# Altium project Zynq7000 SOM.PrjPcb (part 2 of 2)

## Sheet 1GB DDR3L Modules.SchDoc
size A3; SheetNumber: 8; SheetTotal: 11
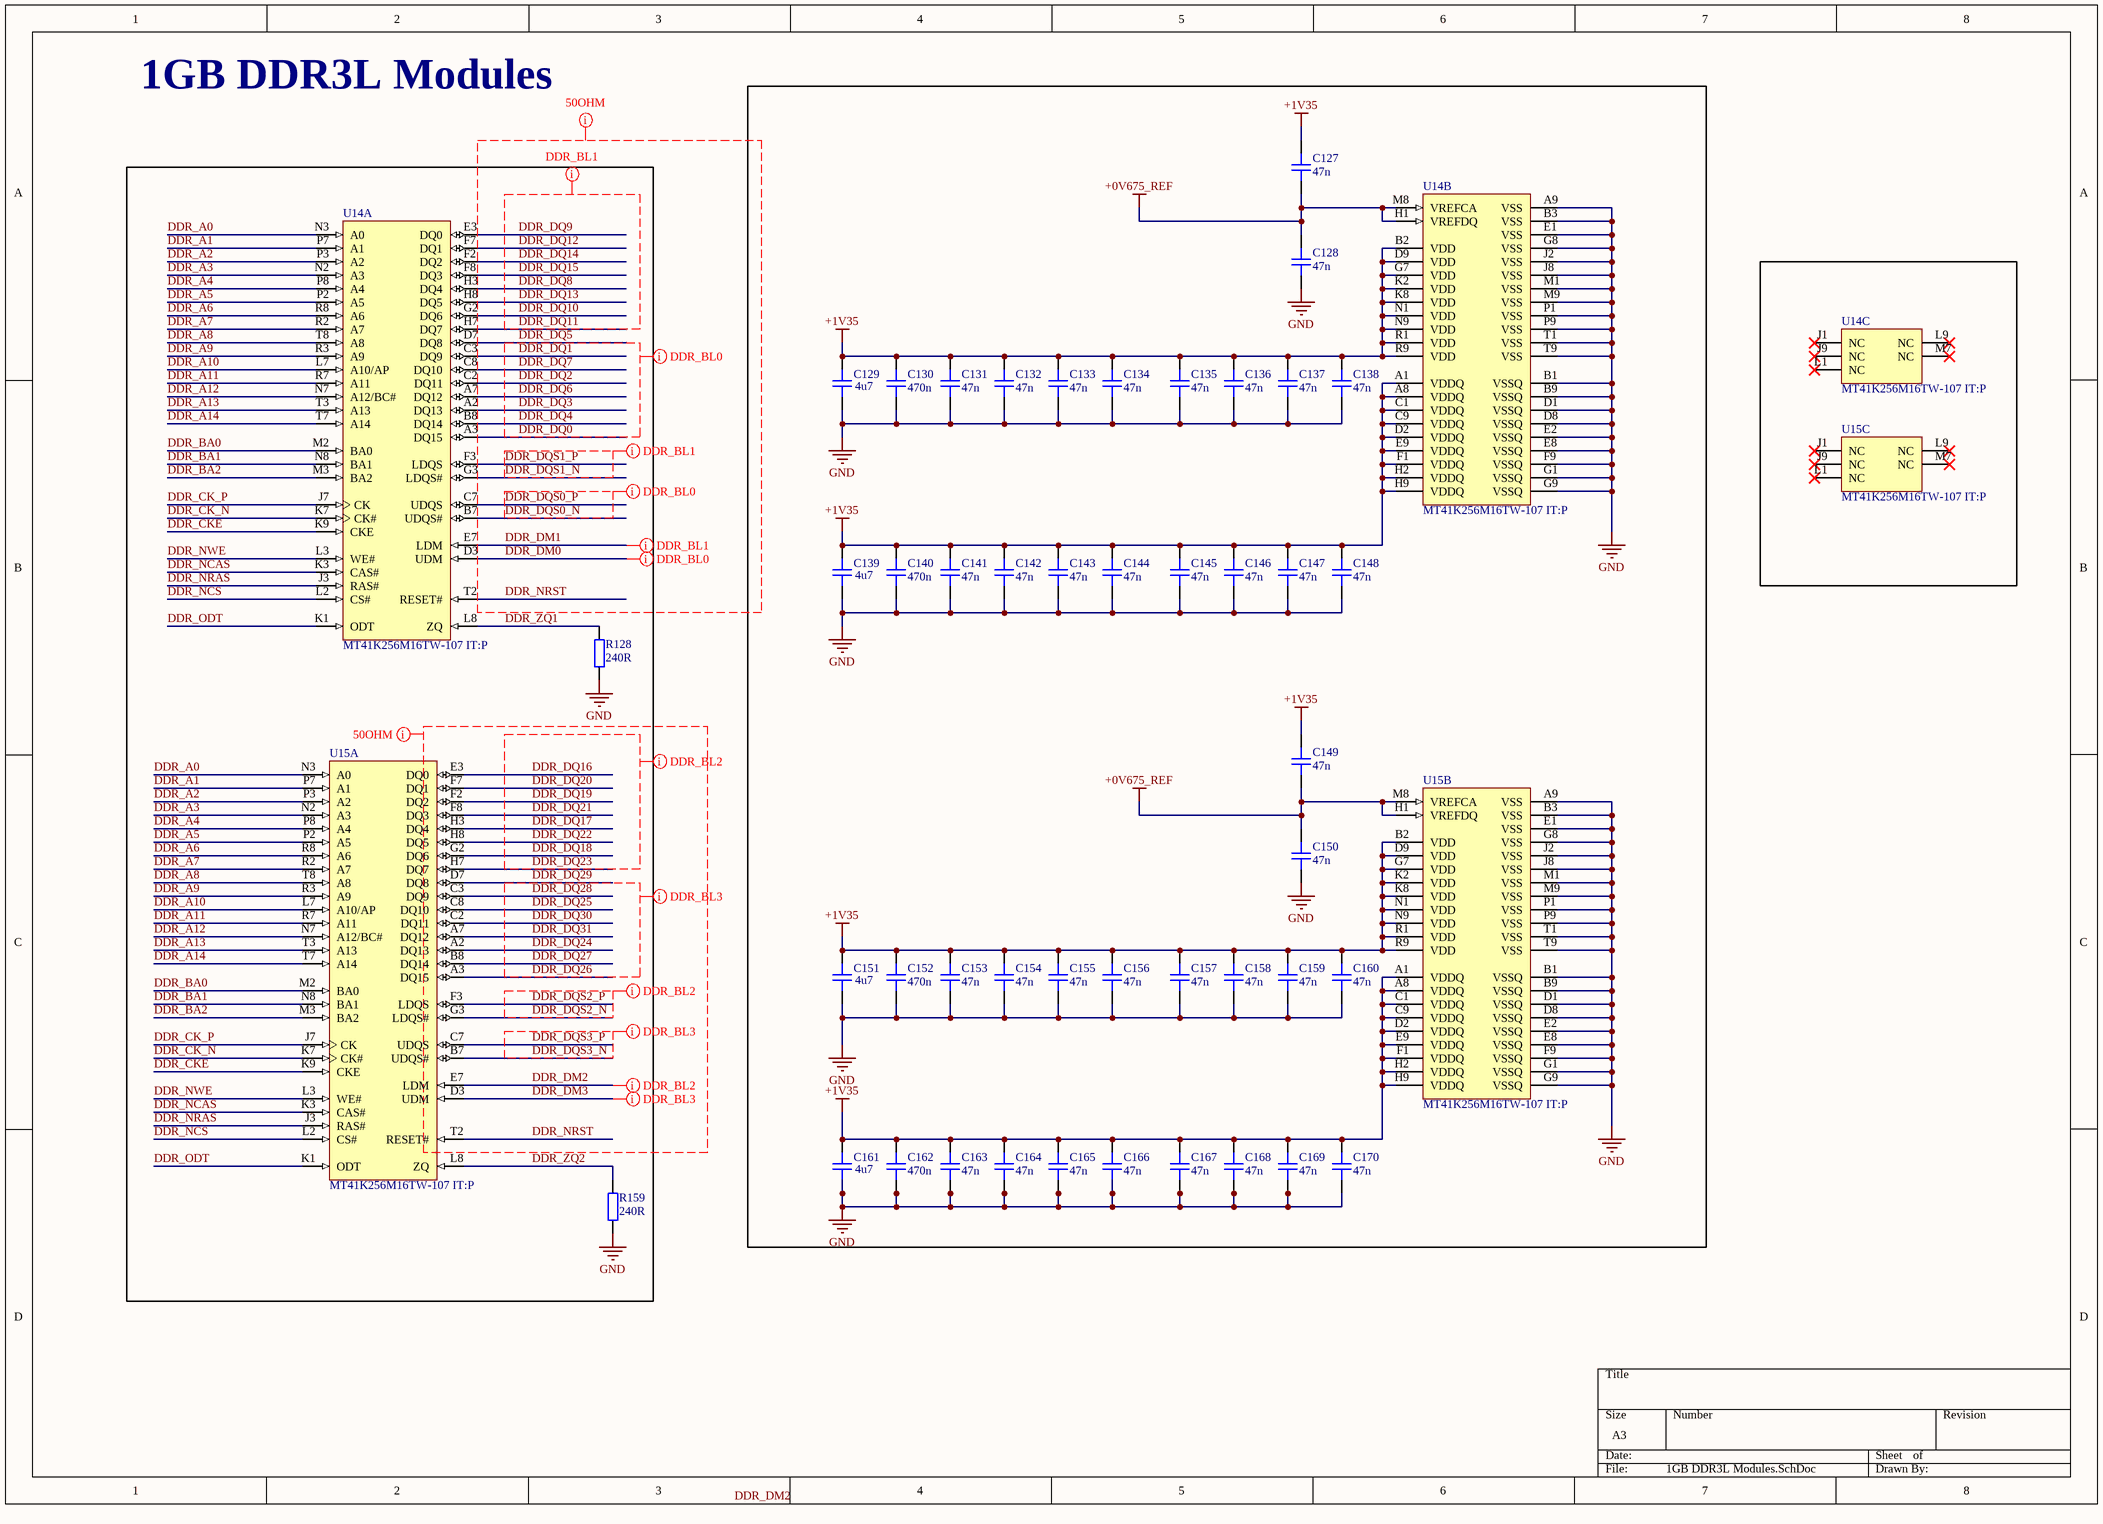
[diagram p9: 1GB DDR3L Modules.SchDoc]

### Parts
C127  value 47n  [CAP_0201]  (hidden comment: C0201)
C128  value 47n  [CAP_0201]  (hidden comment: C0201)
C129  value 4u7  [CAP_0402]  (hidden comment: C0402)
C130  value 470n  [CAP_0201]  (hidden comment: C0201)
C131  value 47n  [CAP_0201]  (hidden comment: C0201)
C132  value 47n  [CAP_0201]  (hidden comment: C0201)
C133  value 47n  [CAP_0201]  (hidden comment: C0201)
C134  value 47n  [CAP_0201]  (hidden comment: C0201)
C135  value 47n  [CAP_0201]  (hidden comment: C0201)
C136  value 47n  [CAP_0201]  (hidden comment: C0201)
C137  value 47n  [CAP_0201]  (hidden comment: C0201)
C138  value 47n  [CAP_0201]  (hidden comment: C0201)
C139  value 4u7  [CAP_0402]  (hidden comment: C0402)
C140  value 470n  [CAP_0201]  (hidden comment: C0201)
C141  value 47n  [CAP_0201]  (hidden comment: C0201)
C142  value 47n  [CAP_0201]  (hidden comment: C0201)
C143  value 47n  [CAP_0201]  (hidden comment: C0201)
C144  value 47n  [CAP_0201]  (hidden comment: C0201)
C145  value 47n  [CAP_0201]  (hidden comment: C0201)
C146  value 47n  [CAP_0201]  (hidden comment: C0201)
C147  value 47n  [CAP_0201]  (hidden comment: C0201)
C148  value 47n  [CAP_0201]  (hidden comment: C0201)
C149  value 47n  [CAP_0201]  (hidden comment: C0201)
C150  value 47n  [CAP_0201]  (hidden comment: C0201)
C151  value 4u7  [CAP_0402]  (hidden comment: C0402)
C152  value 470n  [CAP_0201]  (hidden comment: C0201)
C153  value 47n  [CAP_0201]  (hidden comment: C0201)
C154  value 47n  [CAP_0201]  (hidden comment: C0201)
C155  value 47n  [CAP_0201]  (hidden comment: C0201)
C156  value 47n  [CAP_0201]  (hidden comment: C0201)
C157  value 47n  [CAP_0201]  (hidden comment: C0201)
C158  value 47n  [CAP_0201]  (hidden comment: C0201)
C159  value 47n  [CAP_0201]  (hidden comment: C0201)
C160  value 47n  [CAP_0201]  (hidden comment: C0201)
C161  value 4u7  [CAP_0402]  (hidden comment: C0402)
C162  value 470n  [CAP_0201]  (hidden comment: C0201)
C163  value 47n  [CAP_0201]  (hidden comment: C0201)
C164  value 47n  [CAP_0201]  (hidden comment: C0201)
C165  value 47n  [CAP_0201]  (hidden comment: C0201)
C166  value 47n  [CAP_0201]  (hidden comment: C0201)
C167  value 47n  [CAP_0201]  (hidden comment: C0201)
C168  value 47n  [CAP_0201]  (hidden comment: C0201)
C169  value 47n  [CAP_0201]  (hidden comment: C0201)
C170  value 47n  [CAP_0201]  (hidden comment: C0201)
R128  value 240R  [RES_0402]  (hidden comment: R0402)
R159  value 240R  [RES_0402]  (hidden comment: R0402)
U14  MT41K256M16TW-107 IT:P  [MICT-TW-96]  (parts A,B,C of 3)
U15  MT41K256M16TW-107 IT:P  [MICT-TW-96]  (parts A,B,C of 3)

### Nets
+0V675_Ref: C127.1 C128.2 C149.1 C150.2 U14.H1(VREFDQ) U14.M8(VREFCA) U15.H1(VREFDQ) U15.M8(VREFCA)
+1V35: C127.2 C129.2 C130.2 C131.2 C132.2 C133.2 C134.2 C135.2 C136.2 C137.2 C138.2 C139.2 C140.2 C141.2 C142.2 C143.2 C144.2 C145.2 C146.2 C147.2 C148.2 C149.2 C151.2 C152.2 C153.2 C154.2 C155.2 C156.2 C157.2 C158.2 C159.2 C160.2 C161.2 C162.2 C163.2 C164.2 C165.2 C166.2 C167.2 C168.2 C169.2 C170.2 U14.A1(VDDQ) U14.A8(VDDQ) U14.B2(VDD) U14.C1(VDDQ) U14.C9(VDDQ) U14.D2(VDDQ) U14.D9(VDD) U14.E9(VDDQ) U14.F1(VDDQ) U14.G7(VDD) U14.H2(VDDQ) U14.H9(VDDQ) U14.K2(VDD) U14.K8(VDD) U14.N1(VDD) U14.N9(VDD) U14.R1(VDD) U14.R9(VDD) U15.A1(VDDQ) U15.A8(VDDQ) U15.B2(VDD) U15.C1(VDDQ) U15.C9(VDDQ) U15.D2(VDDQ) U15.D9(VDD) U15.E9(VDDQ) U15.F1(VDDQ) U15.G7(VDD) U15.H2(VDDQ) U15.H9(VDDQ) U15.K2(VDD) U15.K8(VDD) U15.N1(VDD) U15.N9(VDD) U15.R1(VDD) U15.R9(VDD)
GND: C128.1 C129.1 C130.1 C131.1 C132.1 C133.1 C134.1 C135.1 C136.1 C137.1 C138.1 C139.1 C140.1 C141.1 C142.1 C143.1 C144.1 C145.1 C146.1 C147.1 C148.1 C150.1 C151.1 C152.1 C153.1 C154.1 C155.1 C156.1 C157.1 C158.1 C159.1 C160.1 C161.1 C162.1 C163.1 C164.1 C165.1 C166.1 C167.1 C168.1 C169.1 C170.1 R128.2 R159.2 U14.A9(VSS) U14.B1(VSSQ) U14.B3(VSS) U14.B9(VSSQ) U14.D1(VSSQ) U14.D8(VSSQ) U14.E1(VSS) U14.E2(VSSQ) U14.E8(VSSQ) U14.F9(VSSQ) U14.G1(VSSQ) U14.G8(VSS) U14.G9(VSSQ) U14.J2(VSS) U14.J8(VSS) U14.M1(VSS) U14.M9(VSS) U14.P1(VSS) U14.P9(VSS) U14.T1(VSS) U14.T9(VSS) U15.A9(VSS) U15.B1(VSSQ) U15.B3(VSS) U15.B9(VSSQ) U15.D1(VSSQ) U15.D8(VSSQ) U15.E1(VSS) U15.E2(VSSQ) U15.E8(VSSQ) U15.F9(VSSQ) U15.G1(VSSQ) U15.G8(VSS) U15.G9(VSSQ) U15.J2(VSS) U15.J8(VSS) U15.M1(VSS) U15.M9(VSS) U15.P1(VSS) U15.P9(VSS) U15.T1(VSS) U15.T9(VSS)
DDR_A0: U14.N3(A0) U15.N3(A0)
DDR_A1: U14.P7(A1) U15.P7(A1)
DDR_A2: U14.P3(A2) U15.P3(A2)
DDR_A3: U14.N2(A3) U15.N2(A3)
DDR_A4: U14.P8(A4) U15.P8(A4)
DDR_A5: U14.P2(A5) U15.P2(A5)
DDR_A6: U14.R8(A6) U15.R8(A6)
DDR_A7: U14.R2(A7) U15.R2(A7)
DDR_A8: U14.T8(A8) U15.T8(A8)
DDR_A9: U14.R3(A9) U15.R3(A9)
DDR_A10: U14.L7(A10/AP) U15.L7(A10/AP)
DDR_A11: U14.R7(A11) U15.R7(A11)
DDR_A12: U14.N7(A12/BC#) U15.N7(A12/BC#)
DDR_A13: U14.T3(A13) U15.T3(A13)
DDR_A14: U14.T7(A14) U15.T7(A14)
DDR_BA0: U14.M2(BA0) U15.M2(BA0)
DDR_BA1: U14.N8(BA1) U15.N8(BA1)
DDR_BA2: U14.M3(BA2) U15.M3(BA2)
DDR_CK_N: U14.K7(CK#) U15.K7(CK#)
DDR_CK_P: U14.J7(CK) U15.J7(CK)
DDR_CKE: U14.K9(CKE) U15.K9(CKE)
DDR_DM0: U14.D3(UDM)
DDR_DM1: U14.E7(LDM)
DDR_DM2: U15.E7(LDM)
DDR_DM3: U15.D3(UDM)
DDR_DQ0: U14.A3(DQ15)
DDR_DQ1: U14.C3(DQ9)
DDR_DQ2: U14.C2(DQ11)
DDR_DQ3: U14.A2(DQ13)
DDR_DQ4: U14.B8(DQ14)
DDR_DQ5: U14.D7(DQ8)
DDR_DQ6: U14.A7(DQ12)
DDR_DQ7: U14.C8(DQ10)
DDR_DQ8: U14.H3(DQ4)
DDR_DQ9: U14.E3(DQ0)
DDR_DQ10: U14.G2(DQ6)
DDR_DQ11: U14.H7(DQ7)
DDR_DQ12: U14.F7(DQ1)
DDR_DQ13: U14.H8(DQ5)
DDR_DQ14: U14.F2(DQ2)
DDR_DQ15: U14.F8(DQ3)
DDR_DQ16: U15.E3(DQ0)
DDR_DQ17: U15.H3(DQ4)
DDR_DQ18: U15.G2(DQ6)
DDR_DQ19: U15.F2(DQ2)
DDR_DQ20: U15.F7(DQ1)
DDR_DQ21: U15.F8(DQ3)
DDR_DQ22: U15.H8(DQ5)
DDR_DQ23: U15.H7(DQ7)
DDR_DQ24: U15.A2(DQ13)
DDR_DQ25: U15.C8(DQ10)
DDR_DQ26: U15.A3(DQ15)
DDR_DQ27: U15.B8(DQ14)
DDR_DQ28: U15.C3(DQ9)
DDR_DQ29: U15.D7(DQ8)
DDR_DQ30: U15.C2(DQ11)
DDR_DQ31: U15.A7(DQ12)
DDR_DQS0_N: U14.B7(UDQS#)
DDR_DQS0_P: U14.C7(UDQS)
DDR_DQS1_N: U14.G3(LDQS#)
DDR_DQS1_P: U14.F3(LDQS)
DDR_DQS2_N: U15.G3(LDQS#)
DDR_DQS2_P: U15.F3(LDQS)
DDR_DQS3_N: U15.B7(UDQS#)
DDR_DQS3_P: U15.C7(UDQS)
DDR_NCAS: U14.K3(CAS#) U15.K3(CAS#)
DDR_NCS: U14.L2(CS#) U15.L2(CS#)
DDR_NRAS: U14.J3(RAS#) U15.J3(RAS#)
DDR_NRST: U14.T2(RESET#) U15.T2(RESET#)
DDR_NWE: U14.L3(WE#) U15.L3(WE#)
DDR_ODT: U14.K1(ODT) U15.K1(ODT)
DDR_ZQ1: R128.1 U14.L8(ZQ)
DDR_ZQ2: R159.1 U15.L8(ZQ)

Not connected (* = marked no-connect by the designer): U14 J1(NC)* J9(NC)* L1(NC)* L9(NC)* M7(NC)*; U15 J1(NC)* J9(NC)* L1(NC)* L9(NC)* M7(NC)*

### Layout directives
net class DDR_BL1: DDR_DM1, DDR_DQ8, DDR_DQ9, DDR_DQ10, DDR_DQ11, DDR_DQ12, DDR_DQ13, DDR_DQ14, DDR_DQ15, DDR_DQS1_N, DDR_DQS1_P
net class DDR_BL0: DDR_DM0, DDR_DQ0, DDR_DQ1, DDR_DQ2, DDR_DQ3, DDR_DQ4, DDR_DQ5, DDR_DQ6, DDR_DQ7, DDR_DQS0_N, DDR_DQS0_P
net class DDR_BL2: DDR_DM2, DDR_DQ16, DDR_DQ17, DDR_DQ18, DDR_DQ19, DDR_DQ20, DDR_DQ21, DDR_DQ22, DDR_DQ23, DDR_DQS2_N, DDR_DQS2_P
net class DDR_BL3: DDR_DM3, DDR_DQ24, DDR_DQ25, DDR_DQ26, DDR_DQ27, DDR_DQ28, DDR_DQ29, DDR_DQ30, DDR_DQ31, DDR_DQS3_N, DDR_DQS3_P
net class 50OHM: DDR_DM0, DDR_DM1, DDR_DM2, DDR_DM3, DDR_DQ0, DDR_DQ1, DDR_DQ2, DDR_DQ3, DDR_DQ4, DDR_DQ5, DDR_DQ6, DDR_DQ7, DDR_DQ8, DDR_DQ9, DDR_DQ10, DDR_DQ11, DDR_DQ12, DDR_DQ13, DDR_DQ14, DDR_DQ15, DDR_DQ16, DDR_DQ17, DDR_DQ18, DDR_DQ19, DDR_DQ20, DDR_DQ21, DDR_DQ22, DDR_DQ23, DDR_DQ24, DDR_DQ25, DDR_DQ26, DDR_DQ27, DDR_DQ28, DDR_DQ29, DDR_DQ30, DDR_DQ31, DDR_DQS0_N, DDR_DQS0_P, DDR_DQS1_N, DDR_DQS1_P, DDR_DQS2_N, DDR_DQS2_P, DDR_DQS3_N, DDR_DQS3_P, DDR_NRST

### Notes on the sheet
- 1GB DDR3L Modules
- Labels drawn without touching a wire or pin: DDR_DM2

### Library data of the parts
C127 C128 C130-C138 C140-C150 C152-C160 C162-C170 = CAP_0201: Capacitor SMD 0201; Rating: 16V; Manufacturer: *; Manufacturer Part Number: *; Distributor Link: *; LCSC: *; Dielectric: *
C129 C139 C151 C161 = CAP_0402: Capacitor SMD 0402; Manufacturer: *; Manufacturer Part Number: *; Distributor Link: *; LCSC: *; Rating: *; Dielectric: *
R128 R159 = RES_0402: Resistor SMD 0402; Manufacturer: *; Manufacturer Part Number: *; Distributor Link: *; LCSC: *
U14 U15 = CMP-2000-06773-2: Automotive DDR3L SDRAM, 4 GB, 933 MHz, 1.283 to 1.45 V, -40 to 95 degC, 96-Pin TFBGA, RoHS, Tray; Manufacturer: Micron; Data Bus Width: 16b; Address Bus Width: 15b; Operating Supply Voltage: 1.35V; Access Time: 1.07ns; Max Frequency: 933MHz; Density: 4Gb; Package Reference: TW-96; Max Operating Temperature: 95degC; RoHSCompliant: true; Datasheet Version: Rev. D, 02/2017; Datasheet URL: https://www.micron.com/~/media/documents/products/data-sheet/dram/ddr3/4gb_automotive_ddr3l.pdf; Mount: SurfaceMount; Min Operating Temperature: -40degC; Package Description: 96-Ball Fine Pitch Ball Grid Array, Body 14 x 8 mm, Pitch 0.8 mm; Mounting Technology: SurfaceMount; Contact Plating: Silver; Manufacturer URL: http://www.micron.com/

## Sheet Gigabit Ethernet.SchDoc
size A3; SheetNumber: 9; SheetTotal: 11
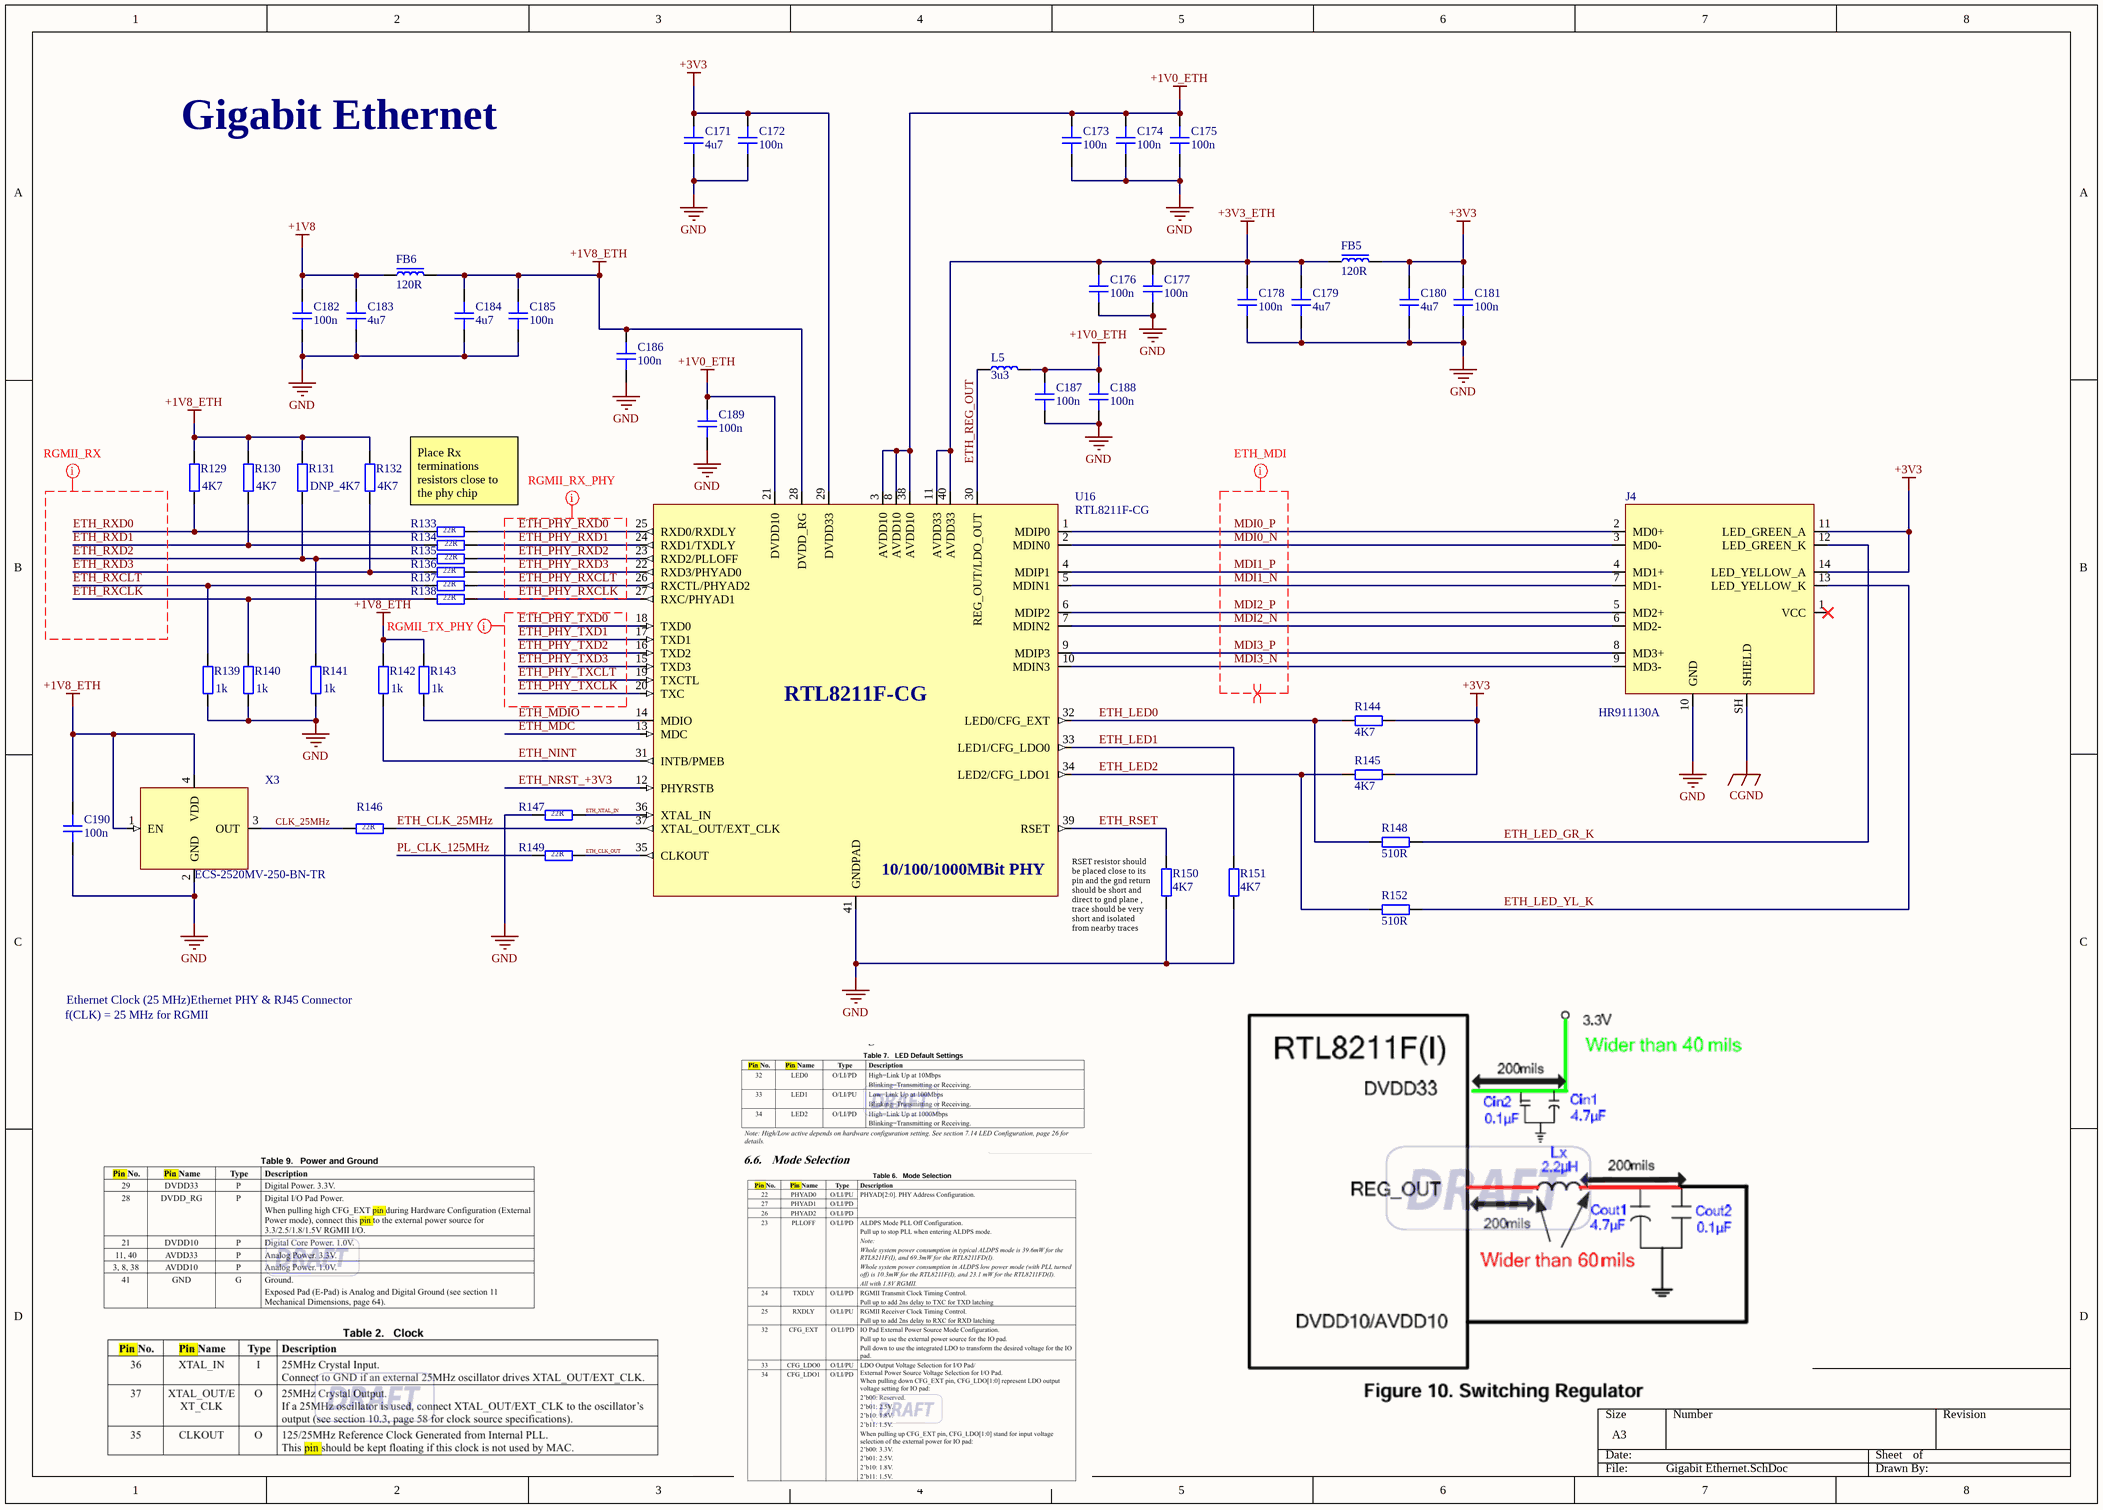
[diagram p10: Gigabit Ethernet.SchDoc]

### Parts
C171  4u7  [CAP_0402]
C172  100n  [CAP_0402]
C173  100n  [CAP_0402]
C174  100n  [CAP_0402]
C175  100n  [CAP_0402]
C176  100n  [CAP_0402]
C177  100n  [CAP_0402]
C178  100n  [CAP_0402]
C179  4u7  [CAP_0402]
C180  4u7  [CAP_0402]
C181  100n  [CAP_0402]
C182  100n  [CAP_0402]
C183  4u7  [CAP_0402]
C184  4u7  [CAP_0402]
C185  100n  [CAP_0402]
C186  100n  [CAP_0402]
C187  100n  [CAP_0402]
C188  100n  [CAP_0402]
C189  100n  [CAP_0402]
C190  100n  [CAP_0402]
FB5  120R  [FB_0402]
FB6  120R  [FB_0402]
J4  HR911130A  [HR911130A]
L5  value 3u3  [IND_0402]  (hidden comment: L0402)
R129  value 4K7  [RES_0402]  (hidden comment: R0402)
R130  value 4K7  [RES_0402]  (hidden comment: R0402)
R131  value DNP_4K7  [RES_0402]  (hidden comment: R0402)
R132  value 4K7  [RES_0402]  (hidden comment: R0402)
R133  value 22R  [RES_0402]  (hidden comment: R0402)
R134  value 22R  [RES_0402]  (hidden comment: R0402)
R135  value 22R  [RES_0402]  (hidden comment: R0402)
R136  value 22R  [RES_0402]  (hidden comment: R0402)
R137  value 22R  [RES_0402]  (hidden comment: R0402)
R138  value 22R  [RES_0402]  (hidden comment: R0402)
R139  value 1k  [RES_0402]  (hidden comment: R0402)
R140  value 1k  [RES_0402]  (hidden comment: R0402)
R141  value 1k  [RES_0402]  (hidden comment: R0402)
R142  value 1k  [RES_0402]  (hidden comment: R0402)
R143  value 1k  [RES_0402]  (hidden comment: R0402)
R144  value 4K7  [RES_0402]  (hidden comment: R0402)
R145  value 4K7  [RES_0402]  (hidden comment: R0402)
R146  value 22R  [RES_0402]  (hidden comment: R0402)
R147  value 22R  [RES_0402]  (hidden comment: R0402)
R148  value 510R  [RES_0402]  (hidden comment: R0402)
R149  value 22R  [RES_0402]  (hidden comment: R0402)
R150  value 4K7  [RES_0402]  (hidden comment: R0402)
R151  value 4K7  [RES_0402]  (hidden comment: R0402)
R152  value 510R  [RES_0402]  (hidden comment: R0402)
U16  RTL8211F-CG  [QFN-40-0.4-EP]
X3  ECS-2520MV-250-BN-TR  [XTAL_2520]

### Nets
+1V0_ETH: C173.2 C174.2 C175.2 C187.2 C188.2 C189.2 L5.2 U16.3(AVDD10) U16.8(AVDD10) U16.21(DVDD10) U16.38(AVDD10)
+1V8: C182.2 C183.2 FB6.1
+1V8_ETH: C184.2 C185.2 C186.2 C190.2 FB6.2 R129.2 R130.2 R131.2 R132.2 R142.2 R143.2 U16.28(DVDD_RG) X3.1(EN) X3.4(VDD)
+3V3: C171.2 C172.2 C180.2 C181.2 FB5.1 J4.11(LED_GREEN_A) J4.14(LED_YELLOW_A) R144.1 R145.1 U16.29(DVDD33)
+3V3_ETH: C176.2 C177.2 C178.2 C179.2 FB5.2 U16.11(AVDD33) U16.40(AVDD33)
CGND: J4.SH(SHIELD)
GND: C171.1 C172.1 C173.1 C174.1 C175.1 C176.1 C177.1 C178.1 C179.1 C180.1 C181.1 C182.1 C183.1 C184.1 C185.1 C186.1 C187.1 C188.1 C189.1 C190.1 J4.10(GND) R139.1 R140.1 R141.1 R147.2 R150.2 R151.2 U16.41(GNDPAD) X3.2(GND)
CLK_25MHz: R146.2 X3.3(OUT)
ETH_CLK_25MHz: R146.1 U16.37(XTAL_OUT/EXT_CLK)
ETH_CLK_OUT: R149.1 U16.35(CLKOUT)
ETH_LED0: R144.2 R148.2 U16.32(LED0/CFG_EXT)
ETH_LED1: R151.1 U16.33(LED1/CFG_LDO0)
ETH_LED2: R145.2 R152.2 U16.34(LED2/CFG_LDO1)
ETH_LED_GR_K: J4.12(LED_GREEN_K) R148.1
ETH_LED_YL_K: J4.13(LED_YELLOW_K) R152.1
ETH_MDC: U16.13(MDC)
ETH_MDIO: R143.1 U16.14(MDIO)
ETH_NINT: R142.1 U16.31(INTB/PMEB)
ETH_NRST_+3V3: U16.12(PHYRSTB)
ETH_PHY_RXCLK: R138.1 U16.27(RXC/PHYAD1)
ETH_PHY_RXCLT: R137.1 U16.26(RXCTL/PHYAD2)
ETH_PHY_RXD0: R133.1 U16.25(RXD0/RXDLY)
ETH_PHY_RXD1: R134.1 U16.24(RXD1/TXDLY)
ETH_PHY_RXD2: R135.1 U16.23(RXD2/PLLOFF)
ETH_PHY_RXD3: R136.1 U16.22(RXD3/PHYAD0)
ETH_PHY_TXCLK: U16.20(TXC)
ETH_PHY_TXCLT: U16.19(TXCTL)
ETH_PHY_TXD0: U16.18(TXD0)
ETH_PHY_TXD1: U16.17(TXD1)
ETH_PHY_TXD2: U16.16(TXD2)
ETH_PHY_TXD3: U16.15(TXD3)
ETH_REG_OUT: L5.1 U16.30(REG_OUT/LDO_OUT)
ETH_RSET: R150.1 U16.39(RSET)
ETH_RXCLK: R138.2 R140.2
ETH_RXCLT: R137.2 R139.2
ETH_RXD0: R129.1 R133.2
ETH_RXD1: R130.1 R134.2
ETH_RXD2: R131.1 R135.2 R141.2
ETH_RXD3: R132.1 R136.2
ETH_XTAL_IN: R147.1 U16.36(XTAL_IN)
MDI0_N: J4.3(MD0-) U16.2(MDIN0)
MDI0_P: J4.2(MD0+) U16.1(MDIP0)
MDI1_N: J4.7(MD1-) U16.5(MDIN1)
MDI1_P: J4.4(MD1+) U16.4(MDIP1)
MDI2_N: J4.6(MD2-) U16.7(MDIN2)
MDI2_P: J4.5(MD2+) U16.6(MDIP2)
MDI3_N: J4.9(MD3-) U16.10(MDIN3)
MDI3_P: J4.8(MD3+) U16.9(MDIP3)
PL_CLK_125MHz: R149.2

Not connected (* = marked no-connect by the designer): J4 1(VCC)*

### Layout directives
differential pair; differential pair class 100ohm: MDI0_N, MDI0_P, MDI1_N, MDI1_P, MDI2_N, MDI2_P, MDI3_N, MDI3_P
net class ETH_MDI: MDI0_N, MDI0_P, MDI1_N, MDI1_P, MDI2_N, MDI2_P, MDI3_N, MDI3_P
net class RGMII_RX; rule Matched Net Lengths [Delay Tolerance = 20ps]: ETH_RXCLK, ETH_RXCLT, ETH_RXD0, ETH_RXD1, ETH_RXD2, ETH_RXD3
net class RGMII_TX_PHY; rule Matched Net Lengths [Delay Tolerance = 20ps]: ETH_PHY_TXCLK, ETH_PHY_TXCLT, ETH_PHY_TXD0, ETH_PHY_TXD1, ETH_PHY_TXD2, ETH_PHY_TXD3
net class RGMII_RX_PHY; rule Matched Net Lengths [Delay Tolerance = 20ps]: ETH_PHY_RXCLK, ETH_PHY_RXCLT, ETH_PHY_RXD0, ETH_PHY_RXD1, ETH_PHY_RXD2, ETH_PHY_RXD3

### Notes on the sheet
- Gigabit Ethernet
- Place Rx terminations resistors close to the phy chip
- RSET resistor should be placed close to its pin and the gnd return should be short and direct to gnd plane , trace should be very short and isolated from nearby traces
- f(CLK) = 25 MHz for RGMII
- Ethernet Clock (25 MHz)Ethernet PHY & RJ45 Connector
- (in symbol RTL8211F-CG) 10/100/1000MBit PHY

### Library data of the parts
C171-C190 = CAP_0402: Capacitor SMD 0402; Manufacturer: *; Manufacturer Part Number: *; Distributor Link: *; LCSC: *; Rating: *; Dielectric: *; package: 0402
FB5 FB6 = FB_0402: Ferrite Bead SMD 0402; Manufacturer: *; Manufacturer Part Number: *; Distributor Link: *; LCSC: *
J4 = HR911130A: 100/1000Base-T Magnetics Single-Port RJ45 Connector with Integrated Magnetics and LEDs; Manufacturer: Hanrun; Manufacturer Part Number: HR911130A
L5 = IND_0402: Inductor SMD 0402
R129-R152 = RES_0402: Resistor SMD 0402; Manufacturer: *; Manufacturer Part Number: *; Distributor Link: *; LCSC: *
U16 = RTL8211F-CG: INTEGRATED 10/100/1000M ETHERNET PRECISION TRANSCEIVER; Manufacturer: Realtek; Manufacturer Part Number: RTL8211F-CG
X3 = ECS-2520MV-130-BN-TR: Standard Clock Oscillators XO (Standard),13MHz,Standby (Power Down),CMOS, Multi-Volt,1.6 V 3.6 V,+/-50ppm,-40 C 85 C,6mA,Surface Mount,4-SMD, No Lead,(2.50mm x 2.00mm),(0.80mm); Manufacturer: ECS; Manufacturer Part Number: ECS-2520MV-130-BN-TR

## Sheet USB 2.0 High-Speed (OTG).SchDoc
size A3; SheetNumber: 10; SheetTotal: 11
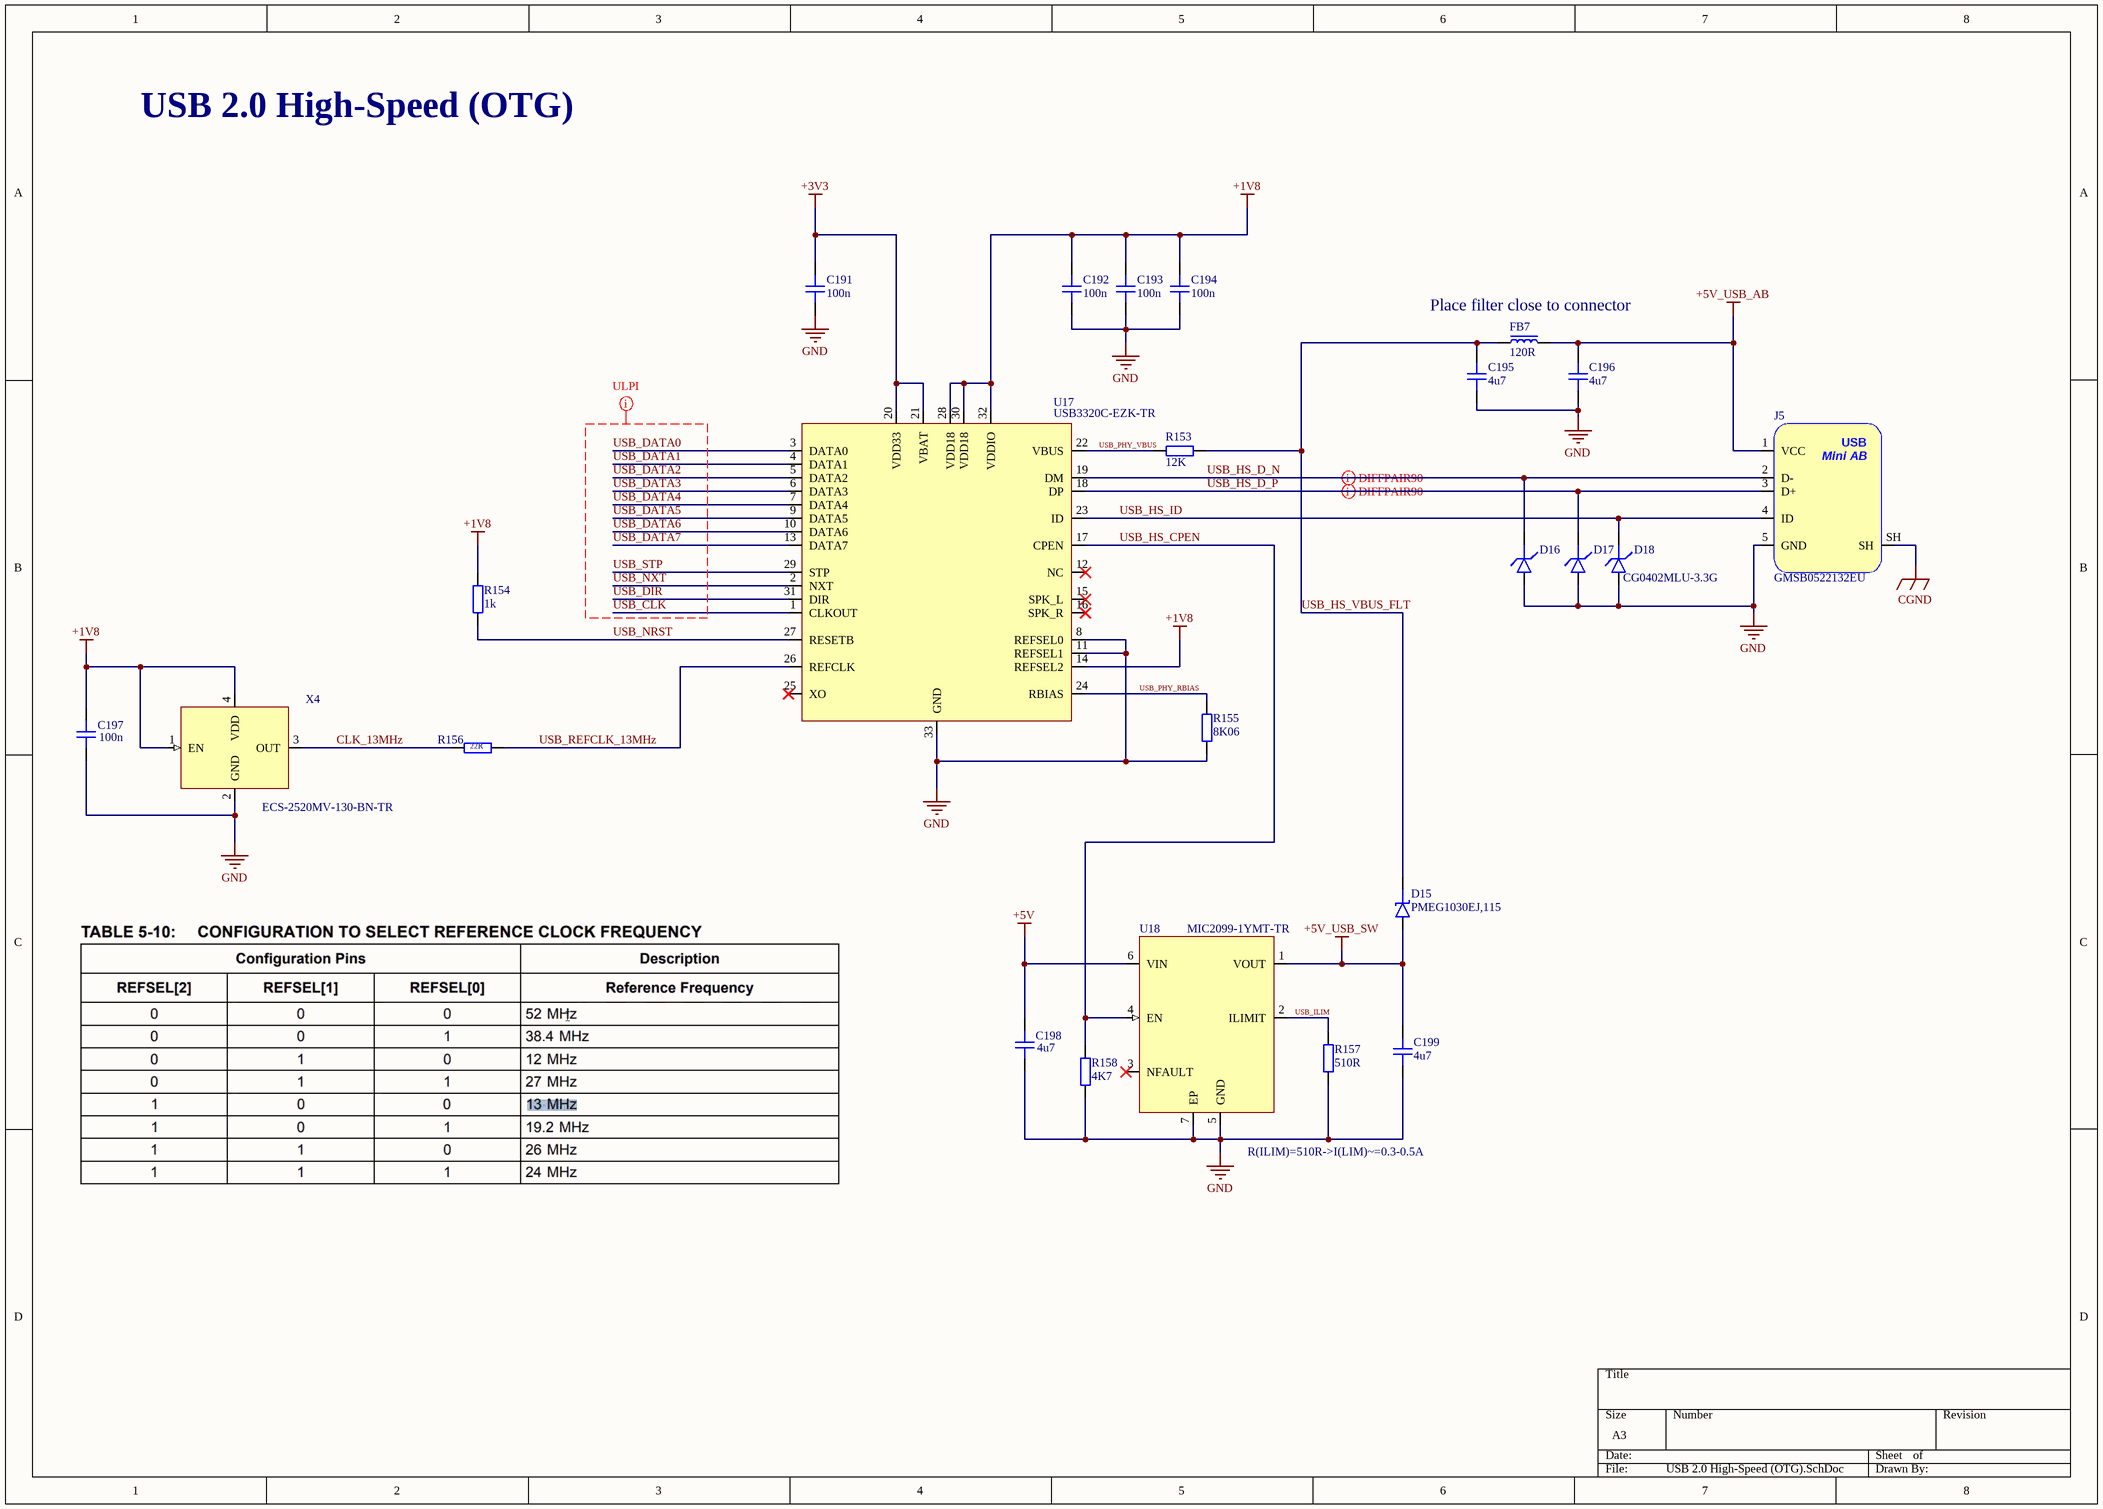
[diagram p11: USB 2.0 High-Speed (OTG).SchDoc]

### Parts
C191  100n  [CAP_0402]
C192  100n  [CAP_0402]
C193  100n  [CAP_0402]
C194  100n  [CAP_0402]
C195  4u7  [CAP_0402]
C196  4u7  [CAP_0402]
C197  value 100n  [CAP_0402]  (hidden comment: C0402)
C198  value 4u7  [CAP_0402]  (hidden comment: C0402)
C199  value 4u7  [CAP_0402]  (hidden comment: C0402)
D15  PMEG1030EJ,115  [SOD-323]
D16  D_TVS_0402  [D_0402]  (value not drawn)
D17  D_TVS_0402  [D_0402]  (value not drawn)
D18  Designator: CG0402MLU-3.3G  [D_0402]  (hidden comment: D_TVS_0402)
FB7  120R  [FB_0402]
J5  GMSB0522132EU  [GMSB0522132EU]
R153  value 12K  [RES_0402]  (hidden comment: R0402)
R154  value 1k  [RES_0402]  (hidden comment: R0402)
R155  value 8K06  [RES_0402]  (hidden comment: R0402)
R156  value 22R  [RES_0402]  (hidden comment: R0402)
R157  value 510R  [RES_0402]  (hidden comment: R0402)
R158  value 4K7  [RES_0402]  (hidden comment: R0402)
U17  USB3320C-EZK-TR  [QFN-32-5x5x0.85mm]
U18  MIC2099-1YMT-TR  [TMLF-6-1_6X1_6]
X4  ECS-2520MV-130-BN-TR  [XTAL_2520]

### Nets
+1V8: C192.2 C193.2 C194.2 C197.2 R154.1 U17.14(REFSEL2) U17.28(VDD18) U17.30(VDD18) U17.32(VDDIO) X4.1(EN) X4.4(VDD)
+3V3: C191.2 U17.20(VDD33) U17.21(VBAT)
+5V: C198.2 U18.6(VIN)
+5V_USB_AB: C196.2 FB7.2 J5.1(VCC)
+5V_USB_SW: C199.2 D15.A U18.1(VOUT)
CGND: J5.SH
GND: C191.1 C192.1 C193.1 C194.1 C195.1 C196.1 C197.1 C198.1 C199.1 D16.A D17.A D18.A J5.5(GND) R155.2 R157.2 R158.2 U17.8(REFSEL0) U17.11(REFSEL1) U17.33(GND) U18.5(GND) U18.7(EP) X4.2(GND)
CLK_13MHz: R156.2 X4.3(OUT)
USB_CLK: U17.1(CLKOUT)
USB_DATA0: U17.3(DATA0)
USB_DATA1: U17.4(DATA1)
USB_DATA2: U17.5(DATA2)
USB_DATA3: U17.6(DATA3)
USB_DATA4: U17.7(DATA4)
USB_DATA5: U17.9(DATA5)
USB_DATA6: U17.10(DATA6)
USB_DATA7: U17.13(DATA7)
USB_DIR: U17.31(DIR)
USB_HS_CPEN: R158.1 U17.17(CPEN) U18.4(EN)
USB_HS_D_N: D16.K J5.2(D-) U17.19(DM)
USB_HS_D_P: D17.K J5.3(D+) U17.18(DP)
USB_HS_ID: D18.K J5.4(ID) U17.23(ID)
USB_HS_VBUS_FLT: C195.2 D15.K FB7.1 R153.2
USB_ILIM: R157.1 U18.2(ILIMIT)
USB_NRST: R154.2 U17.27(RESETB)
USB_NXT: U17.2(NXT)
USB_PHY_RBIAS: R155.1 U17.24(RBIAS)
USB_PHY_VBUS: R153.1 U17.22(VBUS)
USB_REFCLK_13MHz: R156.1 U17.26(REFCLK)
USB_STP: U17.29(STP)

Not connected (* = marked no-connect by the designer): U17 12(NC)* 15(SPK_L)* 16(SPK_R)* 25(XO)*; U18 3(NFAULT)*

### Layout directives
differential pair; differential pair class 90OHM: USB_HS_D_N, USB_HS_D_P
net class ULPI; rule Matched Net Lengths [Delay Tolerance = 10ps]; rule Impedance Constraint [Min = 0.000    Max = 55.00    ]: USB_CLK, USB_DATA0, USB_DATA1, USB_DATA2, USB_DATA3, USB_DATA4, USB_DATA5, USB_DATA6, USB_DATA7, USB_DIR, USB_NXT, USB_STP

### Notes on the sheet
- USB 2.0 High-Speed (OTG)
- (near FB7) Place filter close to connector
- (near U18) R(ILIM)=510R->I(LIM)~=0.3-0.5A
- (in symbol GMSB0522132EU) USB; Mini AB

### Library data of the parts
C191-C199 = CAP_0402: Capacitor SMD 0402; Manufacturer: *; Manufacturer Part Number: *; Distributor Link: *; LCSC: *; Rating: *; Dielectric: *
  C191-C196: package: 0402
D15 = D_SCHOTTKY_SOD_323: Diode Schottky SMD SOD-323
D16 D17 = D_TVS_0402: Diode TVS / ESD 0402; Designator: CG0402MLU-3.3G
D18 = D_TVS_0402: Diode TVS / ESD 0402
FB7 = FB_0402: Ferrite Bead SMD 0402; Manufacturer: *; Manufacturer Part Number: *; Distributor Link: *; LCSC: *
J5 = GMSB0522132EU: USB 2.0 Mini AB Receptacle Right Angle Through-Hole; Manufacturer: Amphenol; Manufacturer Part Number: GMSB0522132EU
R153-R158 = RES_0402: Resistor SMD 0402; Manufacturer: *; Manufacturer Part Number: *; Distributor Link: *; LCSC: *
U17 = USB3320C-EZK-TR: Hi-Speed USB 2.0 ULPI Transceiver; Manufacturer: Microchip; Manufacturer Part Number: USB3320C-EZK-TR
U18 = MIC2099-1YMT-TR: Power Distribution Switch Resistor programmable current limit / – 0.1A to 1.1A 2.5V-5.5V; Manufacturer: Microchip; Manufacturer Part Number: MIC2099-1YMT-TR
X4 = ECS-2520MV-130-BN-TR: as X3 on sheet Gigabit Ethernet; Manufacturer Part Number: ECS-2520MV-130-BN-TR

## Sheet Mezzanine Connectors.SchDoc
size A4; SheetNumber: 11; SheetTotal: 11
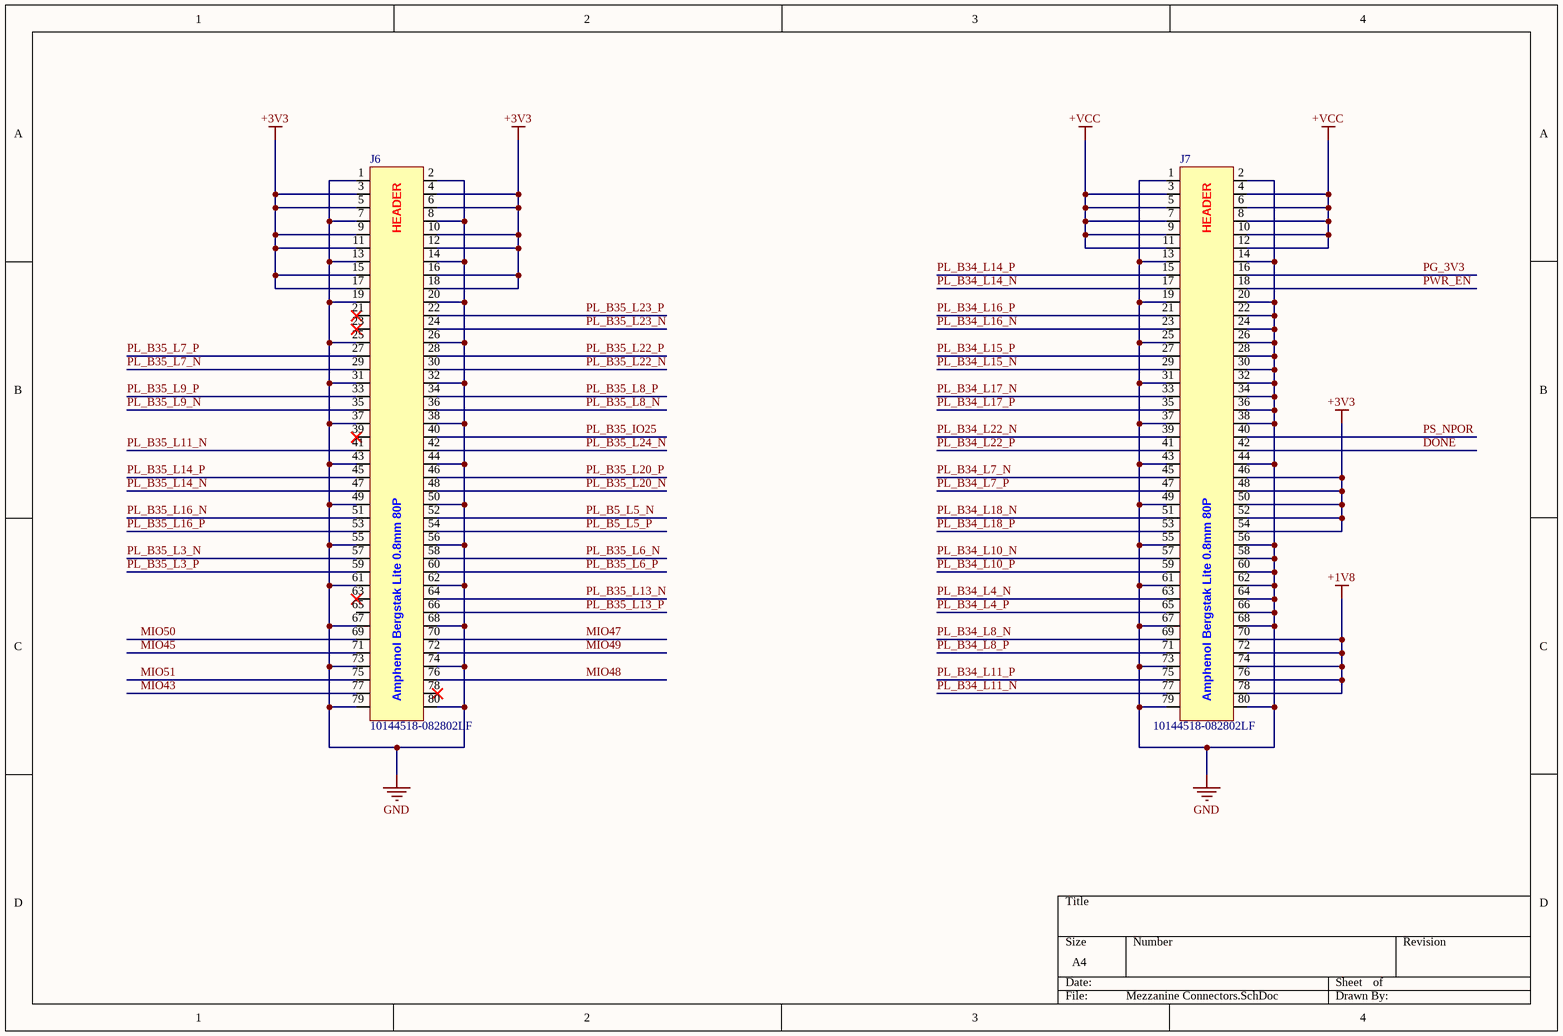
[diagram p12: Mezzanine Connectors.SchDoc]

### Parts
J6  10144518-082802LF  [10144518-082802LF]
J7  10144518-082802LF  [10144518-082802LF]

### Nets
+1V8: J7.70 J7.72 J7.74 J7.76 J7.78
+3V3: J6.3 J6.4 J6.5 J6.6 J6.9 J6.10 J6.11 J6.12 J6.15 J6.16 J6.17 J6.18 J7.46 J7.48 J7.50 J7.52 J7.54
+VCC: J7.3 J7.4 J7.5 J7.6 J7.7 J7.8 J7.9 J7.10 J7.11 J7.12
GND: J6.1 J6.2 J6.7 J6.8 J6.13 J6.14 J6.19 J6.20 J6.25 J6.26 J6.31 J6.32 J6.37 J6.38 J6.43 J6.44 J6.49 J6.50 J6.55 J6.56 J6.61 J6.62 J6.67 J6.68 J6.73 J6.74 J6.79 J6.80 J7.1 J7.2 J7.13 J7.14 J7.19 J7.20 J7.22 J7.24 J7.25 J7.26 J7.28 J7.30 J7.31 J7.32 J7.34 J7.36 J7.37 J7.38 J7.43 J7.44 J7.49 J7.55 J7.56 J7.58 J7.60 J7.61 J7.62 J7.64 J7.66 J7.67 J7.68 J7.73 J7.79 J7.80
DONE: J7.42
MIO43: J6.77
MIO45: J6.71
MIO47: J6.70
MIO48: J6.76
MIO49: J6.72
MIO50: J6.69
MIO51: J6.75
PG_3V3: J7.16
PL_B5_L5_N: J6.52
PL_B5_L5_P: J6.54
PL_B34_L4_N: J7.63
PL_B34_L4_P: J7.65
PL_B34_L7_N: J7.45
PL_B34_L7_P: J7.47
PL_B34_L8_N: J7.69
PL_B34_L8_P: J7.71
PL_B34_L10_N: J7.57
PL_B34_L10_P: J7.59
PL_B34_L11_N: J7.77
PL_B34_L11_P: J7.75
PL_B34_L14_N: J7.17
PL_B34_L14_P: J7.15
PL_B34_L15_N: J7.29
PL_B34_L15_P: J7.27
PL_B34_L16_N: J7.23
PL_B34_L16_P: J7.21
PL_B34_L17_N: J7.33
PL_B34_L17_P: J7.35
PL_B34_L18_N: J7.51
PL_B34_L18_P: J7.53
PL_B34_L22_N: J7.39
PL_B34_L22_P: J7.41
PL_B35_IO25: J6.40
PL_B35_L3_N: J6.57
PL_B35_L3_P: J6.59
PL_B35_L6_N: J6.58
PL_B35_L6_P: J6.60
PL_B35_L7_N: J6.29
PL_B35_L7_P: J6.27
PL_B35_L8_N: J6.36
PL_B35_L8_P: J6.34
PL_B35_L9_N: J6.35
PL_B35_L9_P: J6.33
PL_B35_L11_N: J6.41
PL_B35_L13_N: J6.64
PL_B35_L13_P: J6.66
PL_B35_L14_N: J6.47
PL_B35_L14_P: J6.45
PL_B35_L16_N: J6.51
PL_B35_L16_P: J6.53
PL_B35_L20_N: J6.48
PL_B35_L20_P: J6.46
PL_B35_L22_N: J6.30
PL_B35_L22_P: J6.28
PL_B35_L23_N: J6.24
PL_B35_L23_P: J6.22
PL_B35_L24_N: J6.42
PS_NPOR: J7.40
PWR_EN: J7.18  [project net eFuse_EN]

Not connected (* = marked no-connect by the designer): J6 21* 23* 39* 63* 65 78*

### Notes on the sheet
- (in symbol 10144518-082802LF) HEADER; Amphenol Bergstak Lite 0.8mm 80P

### Library data of the parts
J6 J7 = 10144518-082802LF: BergStak® Lite 0.80mm, Board-to-Board Connector, 80 Positions, Dual Row, Vertical Header; Manufacturer: Amphenol; Manufacturer Part Number: 10144518-082802LF

## Nets that join several sheets
+0V675: Power_supplies (C22.2 C23.2 U5.3 U5.8), Zynq DDR Interface & Termination (36 pins)
+0V675_Ref: Power_supplies (C24.2 U5.4), Zynq DDR Interface & Termination (C125.2 C126.2 U7.H6 U7.P6), 1GB DDR3L Modules (8 pins)
+1V0: Power_supplies (5 pins), Zynq power and decoupling (28 pins)
+1V8: Power_supplies (5 pins), Zynq power and decoupling (29 pins), Zynq processing system (PS) (R72.2 R73.2), Gigabit Ethernet (C182.2 C183.2 FB6.1), USB 2.0 High-Speed (OTG) (11 pins), Mezzanine Connectors (5 pins)
+1V35: Power_supplies (6 pins), Zynq power and decoupling (16 pins), Zynq DDR Interface & Termination (R126.1), 1GB DDR3L Modules (78 pins)
+3V3: Power_supplies (5 pins), Zynq power and decoupling (40 pins), Zynq config, JTAG, Debug (36 pins), Zynq processing system (PS) (34 pins), Zynq programmable logic (PL) (R97.1 R98.1), Gigabit Ethernet (10 pins), USB 2.0 High-Speed (OTG) (C191.2 U17.20 U17.21), Mezzanine Connectors (17 pins)
+5V: Power_supplies (23 pins), USB 2.0 High-Speed (OTG) (C198.2 U18.6)
+VCC: Power_supplies (5 pins), Zynq config, JTAG, Debug (D7.K), Mezzanine Connectors (10 pins)
CGND: Power_supplies (C31.1 R28.1), Zynq config, JTAG, Debug (J3.SH), Gigabit Ethernet (J4.SH), USB 2.0 High-Speed (OTG) (J5.SH)
GND: Power_supplies (55 pins), Zynq power and decoupling (108 pins), Zynq config, JTAG, Debug (53 pins), Zynq processing system (PS) (36 pins), Zynq programmable logic (PL) (Q4.S R100.2), Zynq DDR Interface & Termination (16 pins), 1GB DDR3L Modules (86 pins), Gigabit Ethernet (29 pins), USB 2.0 High-Speed (OTG) (22 pins), Mezzanine Connectors (62 pins)
DDR_A0: Zynq DDR Interface & Termination (R110.1 U7.N2), 1GB DDR3L Modules (U14.N3 U15.N3)
DDR_A1: Zynq DDR Interface & Termination (R111.1 U7.K2), 1GB DDR3L Modules (U14.P7 U15.P7)
DDR_A2: Zynq DDR Interface & Termination (R112.1 U7.M3), 1GB DDR3L Modules (U14.P3 U15.P3)
DDR_A3: Zynq DDR Interface & Termination (R113.1 U7.K3), 1GB DDR3L Modules (U14.N2 U15.N2)
DDR_A4: Zynq DDR Interface & Termination (R114.1 U7.M4), 1GB DDR3L Modules (U14.P8 U15.P8)
DDR_A5: Zynq DDR Interface & Termination (R115.1 U7.L1), 1GB DDR3L Modules (U14.P2 U15.P2)
DDR_A6: Zynq DDR Interface & Termination (R116.1 U7.L4), 1GB DDR3L Modules (U14.R8 U15.R8)
DDR_A7: Zynq DDR Interface & Termination (R117.1 U7.K4), 1GB DDR3L Modules (U14.R2 U15.R2)
DDR_A8: Zynq DDR Interface & Termination (R118.1 U7.K1), 1GB DDR3L Modules (U14.T8 U15.T8)
DDR_A9: Zynq DDR Interface & Termination (R119.1 U7.J4), 1GB DDR3L Modules (U14.R3 U15.R3)
DDR_A10: Zynq DDR Interface & Termination (R120.1 U7.F5), 1GB DDR3L Modules (U14.L7 U15.L7)
DDR_A11: Zynq DDR Interface & Termination (R121.1 U7.G4), 1GB DDR3L Modules (U14.R7 U15.R7)
DDR_A12: Zynq DDR Interface & Termination (R122.1 U7.E4), 1GB DDR3L Modules (U14.N7 U15.N7)
DDR_A13: Zynq DDR Interface & Termination (R123.1 U7.D4), 1GB DDR3L Modules (U14.T3 U15.T3)
DDR_A14: Zynq DDR Interface & Termination (R124.1 U7.F4), 1GB DDR3L Modules (U14.T7 U15.T7)
DDR_BA0: Zynq DDR Interface & Termination (R107.1 U7.L5), 1GB DDR3L Modules (U14.M2 U15.M2)
DDR_BA1: Zynq DDR Interface & Termination (R108.1 U7.R4), 1GB DDR3L Modules (U14.N8 U15.N8)
DDR_BA2: Zynq DDR Interface & Termination (R109.1 U7.J5), 1GB DDR3L Modules (U14.M3 U15.M3)
DDR_CK_N: Zynq DDR Interface & Termination (R101.1 U7.M2), 1GB DDR3L Modules (U14.K7 U15.K7)
DDR_CK_P: Zynq DDR Interface & Termination (R101.2 U7.L2), 1GB DDR3L Modules (U14.J7 U15.J7)
DDR_CKE: Zynq DDR Interface & Termination (R102.1 U7.N3), 1GB DDR3L Modules (U14.K9 U15.K9)
DDR_DM0: Zynq DDR Interface & Termination (U7.A1), 1GB DDR3L Modules (U14.D3)
DDR_DM1: Zynq DDR Interface & Termination (U7.F1), 1GB DDR3L Modules (U14.E7)
DDR_DM2: Zynq DDR Interface & Termination (U7.T1), 1GB DDR3L Modules (U15.E7)
DDR_DM3: Zynq DDR Interface & Termination (U7.Y1), 1GB DDR3L Modules (U15.D3)
DDR_DQ0: Zynq DDR Interface & Termination (U7.C3), 1GB DDR3L Modules (U14.A3)
DDR_DQ1: Zynq DDR Interface & Termination (U7.B3), 1GB DDR3L Modules (U14.C3)
DDR_DQ2: Zynq DDR Interface & Termination (U7.A2), 1GB DDR3L Modules (U14.C2)
DDR_DQ3: Zynq DDR Interface & Termination (U7.A4), 1GB DDR3L Modules (U14.A2)
DDR_DQ4: Zynq DDR Interface & Termination (U7.D3), 1GB DDR3L Modules (U14.B8)
DDR_DQ5: Zynq DDR Interface & Termination (U7.D1), 1GB DDR3L Modules (U14.D7)
DDR_DQ6: Zynq DDR Interface & Termination (U7.C1), 1GB DDR3L Modules (U14.A7)
DDR_DQ7: Zynq DDR Interface & Termination (U7.E1), 1GB DDR3L Modules (U14.C8)
DDR_DQ8: Zynq DDR Interface & Termination (U7.E2), 1GB DDR3L Modules (U14.H3)
DDR_DQ9: Zynq DDR Interface & Termination (U7.E3), 1GB DDR3L Modules (U14.E3)
DDR_DQ10: Zynq DDR Interface & Termination (U7.G3), 1GB DDR3L Modules (U14.G2)
DDR_DQ11: Zynq DDR Interface & Termination (U7.H3), 1GB DDR3L Modules (U14.H7)
DDR_DQ12: Zynq DDR Interface & Termination (U7.J3), 1GB DDR3L Modules (U14.F7)
DDR_DQ13: Zynq DDR Interface & Termination (U7.H2), 1GB DDR3L Modules (U14.H8)
DDR_DQ14: Zynq DDR Interface & Termination (U7.H1), 1GB DDR3L Modules (U14.F2)
DDR_DQ15: Zynq DDR Interface & Termination (U7.J1), 1GB DDR3L Modules (U14.F8)
DDR_DQ16: Zynq DDR Interface & Termination (U7.P1), 1GB DDR3L Modules (U15.E3)
DDR_DQ17: Zynq DDR Interface & Termination (U7.P3), 1GB DDR3L Modules (U15.H3)
DDR_DQ18: Zynq DDR Interface & Termination (U7.R3), 1GB DDR3L Modules (U15.G2)
DDR_DQ19: Zynq DDR Interface & Termination (U7.R1), 1GB DDR3L Modules (U15.F2)
DDR_DQ20: Zynq DDR Interface & Termination (U7.T4), 1GB DDR3L Modules (U15.F7)
DDR_DQ21: Zynq DDR Interface & Termination (U7.U4), 1GB DDR3L Modules (U15.F8)
DDR_DQ22: Zynq DDR Interface & Termination (U7.U2), 1GB DDR3L Modules (U15.H8)
DDR_DQ23: Zynq DDR Interface & Termination (U7.U3), 1GB DDR3L Modules (U15.H7)
DDR_DQ24: Zynq DDR Interface & Termination (U7.V1), 1GB DDR3L Modules (U15.A2)
DDR_DQ25: Zynq DDR Interface & Termination (U7.Y3), 1GB DDR3L Modules (U15.C8)
DDR_DQ26: Zynq DDR Interface & Termination (U7.W1), 1GB DDR3L Modules (U15.A3)
DDR_DQ27: Zynq DDR Interface & Termination (U7.Y4), 1GB DDR3L Modules (U15.B8)
DDR_DQ28: Zynq DDR Interface & Termination (U7.Y2), 1GB DDR3L Modules (U15.C3)
DDR_DQ29: Zynq DDR Interface & Termination (U7.W3), 1GB DDR3L Modules (U15.D7)
DDR_DQ30: Zynq DDR Interface & Termination (U7.V2), 1GB DDR3L Modules (U15.C2)
DDR_DQ31: Zynq DDR Interface & Termination (U7.V3), 1GB DDR3L Modules (U15.A7)
DDR_DQS0_N: Zynq DDR Interface & Termination (U7.B2), 1GB DDR3L Modules (U14.B7)
DDR_DQS0_P: Zynq DDR Interface & Termination (U7.C2), 1GB DDR3L Modules (U14.C7)
DDR_DQS1_N: Zynq DDR Interface & Termination (U7.F2), 1GB DDR3L Modules (U14.G3)
DDR_DQS1_P: Zynq DDR Interface & Termination (U7.G2), 1GB DDR3L Modules (U14.F3)
DDR_DQS2_N: Zynq DDR Interface & Termination (U7.T2), 1GB DDR3L Modules (U15.G3)
DDR_DQS2_P: Zynq DDR Interface & Termination (U7.R2), 1GB DDR3L Modules (U15.F3)
DDR_DQS3_N: Zynq DDR Interface & Termination (U7.W4), 1GB DDR3L Modules (U15.B7)
DDR_DQS3_P: Zynq DDR Interface & Termination (U7.W5), 1GB DDR3L Modules (U15.C7)
DDR_NCAS: Zynq DDR Interface & Termination (R105.1 U7.P5), 1GB DDR3L Modules (U14.K3 U15.K3)
DDR_NCS: Zynq DDR Interface & Termination (R103.1 U7.N1), 1GB DDR3L Modules (U14.L2 U15.L2)
DDR_NRAS: Zynq DDR Interface & Termination (R104.1 U7.P4), 1GB DDR3L Modules (U14.J3 U15.J3)
DDR_NRST: Zynq DDR Interface & Termination (R125.1 U7.B4), 1GB DDR3L Modules (U14.T2 U15.T2)
DDR_NWE: Zynq DDR Interface & Termination (R106.1 U7.M5), 1GB DDR3L Modules (U14.L3 U15.L3)
DDR_ODT: Zynq DDR Interface & Termination (R160.1 U7.N5), 1GB DDR3L Modules (U14.K1 U15.K1)
DONE: Zynq config, JTAG, Debug (Q2.G R34.1 U7.R11), Mezzanine Connectors (J7.42)
eFuse_EN: Power_supplies (C8.2 R5.1 U2.7), Mezzanine Connectors (J7.18)
ETH_MDC: Zynq processing system (PS) (U7.C10), Gigabit Ethernet (U16.13)
ETH_MDIO: Zynq processing system (PS) (U7.C11), Gigabit Ethernet (R143.1 U16.14)
ETH_NINT: Zynq processing system (PS) (U7.E12), Gigabit Ethernet (R142.1 U16.31)
ETH_NRST_+3V3: Zynq processing system (PS) (R93.1 U13.4), Gigabit Ethernet (U16.12)
ETH_PHY_TXCLK: Zynq processing system (PS) (R79.1), Gigabit Ethernet (U16.20)
ETH_PHY_TXCLT: Zynq processing system (PS) (R85.1), Gigabit Ethernet (U16.19)
ETH_PHY_TXD0: Zynq processing system (PS) (R80.1), Gigabit Ethernet (U16.18)
ETH_PHY_TXD1: Zynq processing system (PS) (R81.1), Gigabit Ethernet (U16.17)
ETH_PHY_TXD2: Zynq processing system (PS) (R83.1), Gigabit Ethernet (U16.16)
ETH_PHY_TXD3: Zynq processing system (PS) (R84.1), Gigabit Ethernet (U16.15)
ETH_RXCLK: Zynq processing system (PS) (U7.B17), Gigabit Ethernet (R138.2 R140.2)
ETH_RXCLT: Zynq processing system (PS) (U7.D13), Gigabit Ethernet (R137.2 R139.2)
ETH_RXD0: Zynq processing system (PS) (U7.D11), Gigabit Ethernet (R129.1 R133.2)
ETH_RXD1: Zynq processing system (PS) (U7.A16), Gigabit Ethernet (R130.1 R134.2)
ETH_RXD2: Zynq processing system (PS) (U7.F15), Gigabit Ethernet (R131.1 R135.2 R141.2)
ETH_RXD3: Zynq processing system (PS) (U7.A15), Gigabit Ethernet (R132.1 R136.2)
FLASH_CLK_M4: Zynq config, JTAG, Debug (R59.1), Zynq processing system (PS) (R74.1 U10.6)
MIO43: Zynq processing system (PS) (U7.A9), Mezzanine Connectors (J6.77)
MIO45: Zynq processing system (PS) (U7.B15), Mezzanine Connectors (J6.71)
MIO47: Zynq processing system (PS) (U7.B14), Mezzanine Connectors (J6.70)
MIO48: Zynq processing system (PS) (U7.B12), Mezzanine Connectors (J6.76)
MIO49: Zynq processing system (PS) (U7.C12), Mezzanine Connectors (J6.72)
MIO50: Zynq processing system (PS) (U7.B13), Mezzanine Connectors (J6.69)
MIO51: Zynq processing system (PS) (U7.B9), Mezzanine Connectors (J6.75)
PG_3V3: Power_supplies (5 pins), Zynq processing system (PS) (U11.2), Mezzanine Connectors (J7.16)
PL_B5_L5_N: Zynq programmable logic (PL) (U7.E19), Mezzanine Connectors (J6.52)
PL_B5_L5_P: Zynq programmable logic (PL) (U7.E18), Mezzanine Connectors (J6.54)
PL_B34_L4_N: Zynq programmable logic (PL) (U7.W13), Mezzanine Connectors (J7.63)
PL_B34_L4_P: Zynq programmable logic (PL) (U7.V12), Mezzanine Connectors (J7.65)
PL_B34_L7_N: Zynq programmable logic (PL) (U7.Y17), Mezzanine Connectors (J7.45)
PL_B34_L7_P: Zynq programmable logic (PL) (U7.Y16), Mezzanine Connectors (J7.47)
PL_B34_L8_N: Zynq programmable logic (PL) (U7.Y14), Mezzanine Connectors (J7.69)
PL_B34_L8_P: Zynq programmable logic (PL) (U7.W14), Mezzanine Connectors (J7.71)
PL_B34_L10_N: Zynq programmable logic (PL) (U7.W15), Mezzanine Connectors (J7.57)
PL_B34_L10_P: Zynq programmable logic (PL) (U7.V15), Mezzanine Connectors (J7.59)
PL_B34_L11_N: Zynq programmable logic (PL) (U7.U15), Mezzanine Connectors (J7.77)
PL_B34_L11_P: Zynq programmable logic (PL) (U7.U14), Mezzanine Connectors (J7.75)
PL_B34_L14_N: Zynq programmable logic (PL) (U7.P20), Mezzanine Connectors (J7.17)
PL_B34_L14_P: Zynq programmable logic (PL) (U7.N20), Mezzanine Connectors (J7.15)
PL_B34_L15_N: Zynq programmable logic (PL) (U7.U20), Mezzanine Connectors (J7.29)
PL_B34_L15_P: Zynq programmable logic (PL) (U7.T20), Mezzanine Connectors (J7.27)
PL_B34_L16_N: Zynq programmable logic (PL) (U7.W20), Mezzanine Connectors (J7.23)
PL_B34_L16_P: Zynq programmable logic (PL) (U7.V20), Mezzanine Connectors (J7.21)
PL_B34_L17_N: Zynq programmable logic (PL) (U7.Y19), Mezzanine Connectors (J7.33)
PL_B34_L17_P: Zynq programmable logic (PL) (U7.Y18), Mezzanine Connectors (J7.35)
PL_B34_L18_N: Zynq programmable logic (PL) (U7.W16), Mezzanine Connectors (J7.51)
PL_B34_L18_P: Zynq programmable logic (PL) (U7.V16), Mezzanine Connectors (J7.53)
PL_B34_L22_N: Zynq programmable logic (PL) (U7.W19), Mezzanine Connectors (J7.39)
PL_B34_L22_P: Zynq programmable logic (PL) (U7.W18), Mezzanine Connectors (J7.41)
PL_B35_IO25: Zynq programmable logic (PL) (U7.J15), Mezzanine Connectors (J6.40)
PL_B35_L3_N: Zynq programmable logic (PL) (U7.D18), Mezzanine Connectors (J6.57)
PL_B35_L3_P: Zynq programmable logic (PL) (U7.E17), Mezzanine Connectors (J6.59)
PL_B35_L6_N: Zynq programmable logic (PL) (U7.F17), Mezzanine Connectors (J6.58)
PL_B35_L6_P: Zynq programmable logic (PL) (U7.F16), Mezzanine Connectors (J6.60)
PL_B35_L7_N: Zynq programmable logic (PL) (U7.M20), Mezzanine Connectors (J6.29)
PL_B35_L7_P: Zynq programmable logic (PL) (U7.M19), Mezzanine Connectors (J6.27)
PL_B35_L8_N: Zynq programmable logic (PL) (U7.M18), Mezzanine Connectors (J6.36)
PL_B35_L8_P: Zynq programmable logic (PL) (U7.M17), Mezzanine Connectors (J6.34)
PL_B35_L9_N: Zynq programmable logic (PL) (U7.l20), Mezzanine Connectors (J6.35)
PL_B35_L9_P: Zynq programmable logic (PL) (U7.L19), Mezzanine Connectors (J6.33)
PL_B35_L11_N: Zynq programmable logic (PL) (U7.L17), Mezzanine Connectors (J6.41)
PL_B35_L13_N: Zynq programmable logic (PL) (U7.H17), Mezzanine Connectors (J6.64)
PL_B35_L13_P: Zynq programmable logic (PL) (U7.H16), Mezzanine Connectors (J6.66)
PL_B35_L14_N: Zynq programmable logic (PL) (U7.H18), Mezzanine Connectors (J6.47)
PL_B35_L14_P: Zynq programmable logic (PL) (U7.J18), Mezzanine Connectors (J6.45)
PL_B35_L16_N: Zynq programmable logic (PL) (U7.G18), Mezzanine Connectors (J6.51)
PL_B35_L16_P: Zynq programmable logic (PL) (U7.G17), Mezzanine Connectors (J6.53)
PL_B35_L20_N: Zynq programmable logic (PL) (U7.J14), Mezzanine Connectors (J6.48)
PL_B35_L20_P: Zynq programmable logic (PL) (U7.K14), Mezzanine Connectors (J6.46)
PL_B35_L22_N: Zynq programmable logic (PL) (U7.L15), Mezzanine Connectors (J6.30)
PL_B35_L22_P: Zynq programmable logic (PL) (U7.L14), Mezzanine Connectors (J6.28)
PL_B35_L23_N: Zynq programmable logic (PL) (U7.M15), Mezzanine Connectors (J6.24)
PL_B35_L23_P: Zynq programmable logic (PL) (U7.M14), Mezzanine Connectors (J6.22)
PL_B35_L24_N: Zynq programmable logic (PL) (U7.J16), Mezzanine Connectors (J6.42)
PL_CLK_125MHz: Zynq programmable logic (PL) (U7.K17), Gigabit Ethernet (R149.2)
PS_NPOR: Zynq config, JTAG, Debug (R44.2), Zynq processing system (PS) (C103.1 R70.1 U7.C7 U11.4), Mezzanine Connectors (J7.40)
QSPI_DQ0_M3: Zynq config, JTAG, Debug (R58.1), Zynq processing system (PS) (U7.B8 U10.5)
QSPI_DQ1_M1: Zynq config, JTAG, Debug (R64.1), Zynq processing system (PS) (U7.D6 U10.2)
QSPI_DQ2_M2: Zynq config, JTAG, Debug (R65.1), Zynq processing system (PS) (U7.B7 U10.3)
QSPI_DQ3_M0: Zynq config, JTAG, Debug (R63.1), Zynq processing system (PS) (U7.A6 U10.7)
UART1_RX: Zynq config, JTAG, Debug (R47.2), Zynq processing system (PS) (U7.B5)
UART1_TX_VCFG1: Zynq config, JTAG, Debug (R49.2), Zynq processing system (PS) (R77.2 U7.D5)
USB_CLK: Zynq processing system (PS) (U7.F12), USB 2.0 High-Speed (OTG) (U17.1)
USB_DATA0: Zynq processing system (PS) (U7.E16), USB 2.0 High-Speed (OTG) (U17.3)
USB_DATA1: Zynq processing system (PS) (U7.A14), USB 2.0 High-Speed (OTG) (U17.4)
USB_DATA2: Zynq processing system (PS) (U7.D15), USB 2.0 High-Speed (OTG) (U17.5)
USB_DATA3: Zynq processing system (PS) (U7.A12), USB 2.0 High-Speed (OTG) (U17.6)
USB_DATA4: Zynq processing system (PS) (U7.A11), USB 2.0 High-Speed (OTG) (U17.7)
USB_DATA5: Zynq processing system (PS) (U7.A10), USB 2.0 High-Speed (OTG) (U17.9)
USB_DATA6: Zynq processing system (PS) (U7.E13), USB 2.0 High-Speed (OTG) (U17.10)
USB_DATA7: Zynq processing system (PS) (U7.C18), USB 2.0 High-Speed (OTG) (U17.13)
USB_DIR: Zynq processing system (PS) (U7.C16), USB 2.0 High-Speed (OTG) (U17.31)
USB_NRST: Zynq processing system (PS) (U7.D14), USB 2.0 High-Speed (OTG) (R154.2 U17.27)
USB_NXT: Zynq processing system (PS) (U7.C15), USB 2.0 High-Speed (OTG) (U17.2)
USB_STP: Zynq processing system (PS) (U7.C13), USB 2.0 High-Speed (OTG) (U17.29)

## Assembly variants
Eth_PLL_OFF_pu: not fitted R131